# EAGLE design HID-Bridge-FTDI_proto (EAGLE 6.5.0)
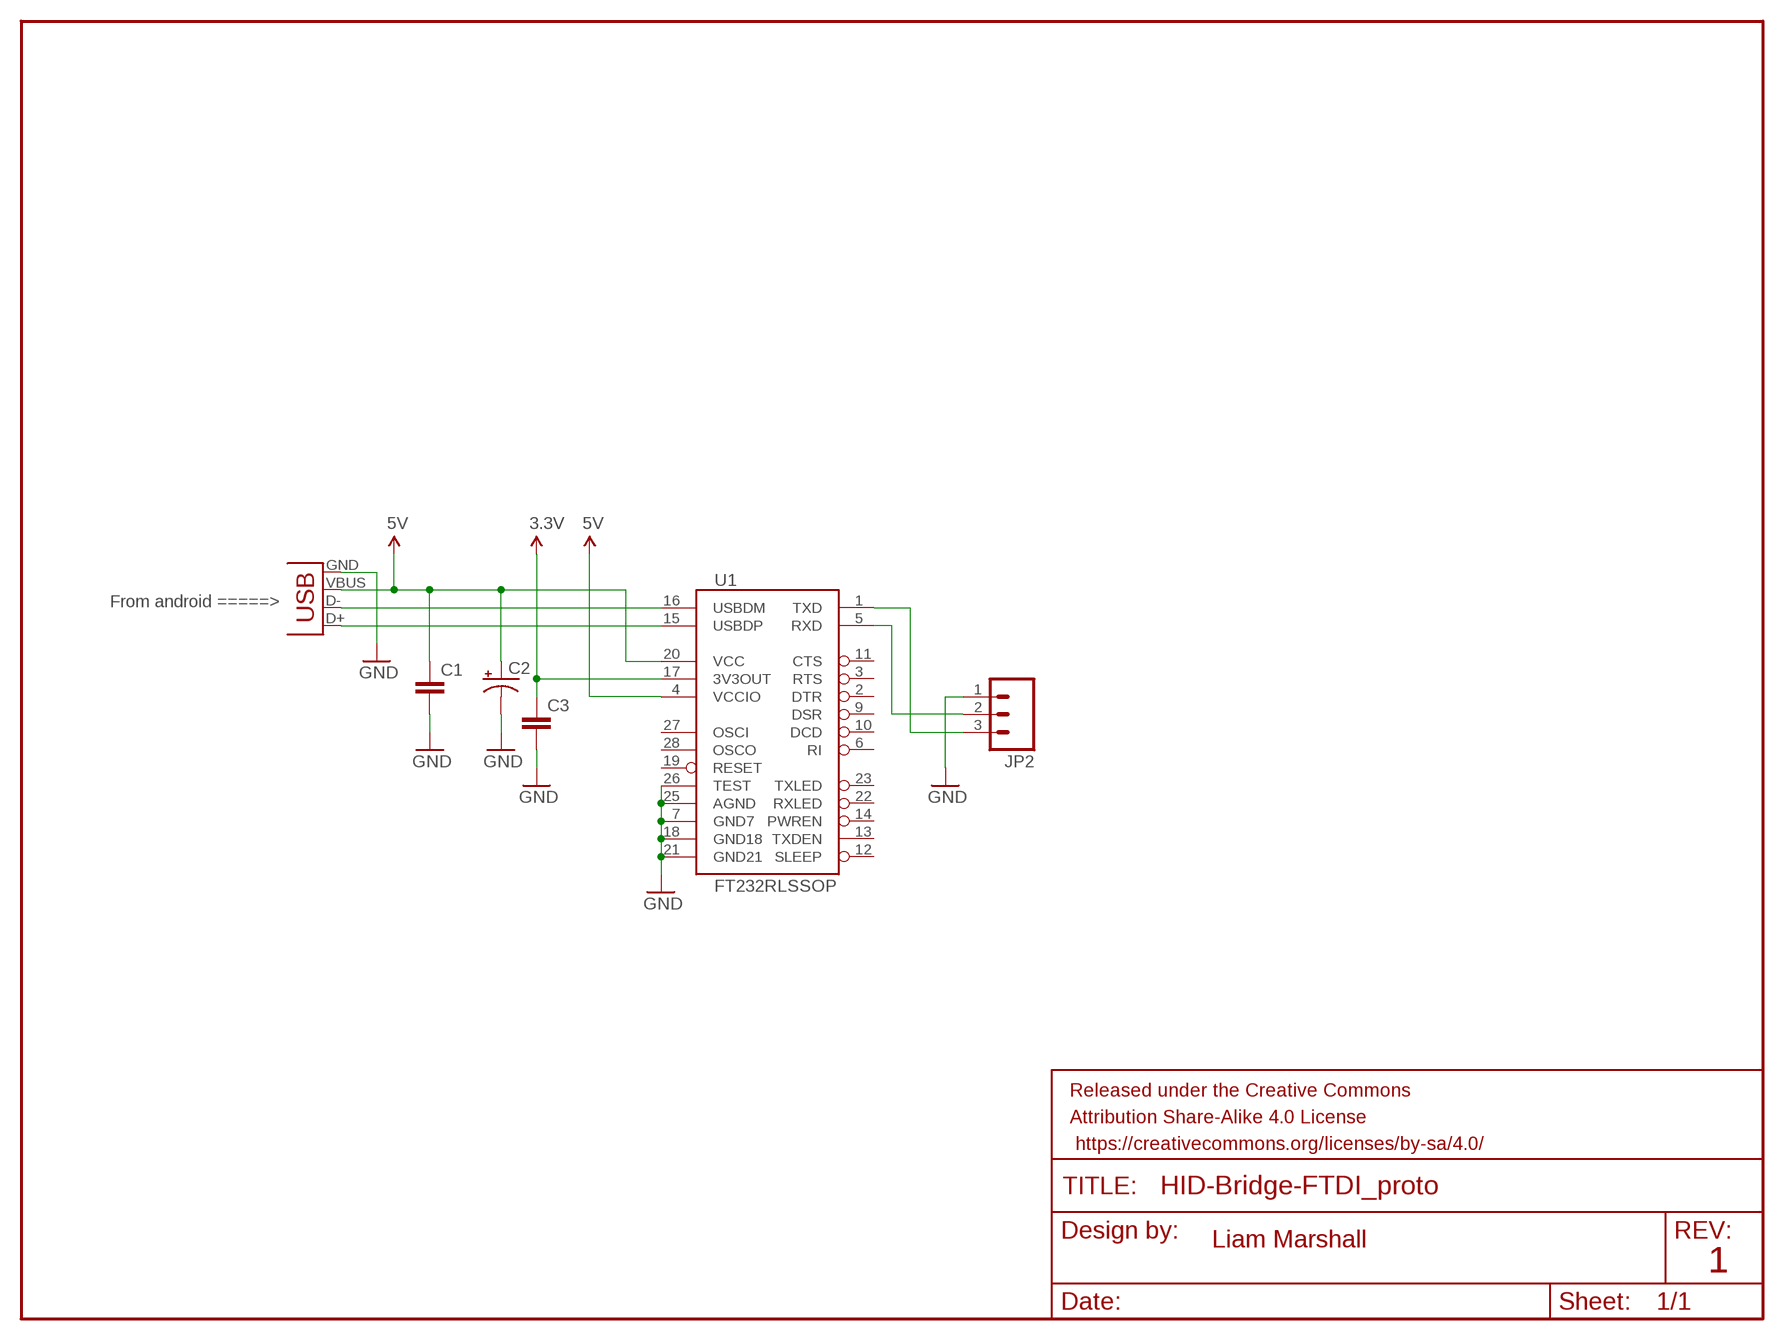
[diagram p0: schematic, sheet 1]

## Parts
C1  0.1UF-50V-20%(PTH)KIT-EZ  [CAP-PTH-SMALL-KIT]
C2  10UF-25V-20%(PTH)  [CPOL-RADIAL-10UF-25V]
C3  0.1UF-50V-20%(PTH)KIT-EZ  [CAP-PTH-SMALL-KIT]
FRAME1  FRAME-LETTER  [CREATIVE_COMMONS]
JP1  USB-B  USBPTH  [USB-B-PTH]
JP2  M03PTH  [1X03]
U1  FT232RLSSOP  [SSOP28DB]

## Nets
3.3V: C3.1 U1.17(3V3OUT)
5V: C1.1 C2.1(+) JP1.VBUS U1.4(VCCIO) U1.20(VCC)
GND: C1.2 C2.2(-) C3.2 JP1.GND JP2.1 U1.7(GND7) U1.18(GND18) U1.21(GND21) U1.25(AGND) U1.26(TEST)
N$1: JP2.2 U1.5(RXD)
N$2: JP1.D+ U1.15(USBDP)
N$3: JP1.D- U1.16(USBDM)
N$4: JP2.3 U1.1(TXD)
Unconnected: U1.2(DTR) U1.3(RTS) U1.6(RI) U1.9(DSR) U1.10(DCD) U1.11(CTS) U1.12(SLEEP) U1.13(TXDEN) U1.14(PWREN) U1.19(RESET) U1.22(RXLED) U1.23(TXLED) U1.27(OSCI) U1.28(OSCO)

## Notes on the sheet
- From android =====>
- Liam Marshall
- 1

## Library data of the parts
C1 C3 = SparkFun-Capacitors:0.1UF-50V-20%(PTH): CAP-08370; PROD_ID: CAP-08370
C2 = SparkFun-Capacitors:10UF-25V-20%(PTH): CAP-08440; PROD_ID: CAP-08440
FRAME1 = SparkFun-Aesthetics:FRAME-LETTER: Schematic Frame Standard 8.5x11 US Letter frame
JP1 = SparkFun-Connectors:USB: USB Connectors USB-B-PTH is fully proven SKU : PRT-00139/CONN-08278 USB-miniB is fully proven SKU : PRT-00587 USB-A-PCB is untested. USB-A-H is throughly reviewed, but untested. Spark Fun Electronics SKU : PRT-00437 USB-B-SMT is throughly reviewed, but untested. Needs silkscreen touching up. USB-A-S has not been used/tested USB-MB-H has not been used/tested USB-MICROB has been used. CONN-09505; PROD_ID: CONN-08278
JP2 = SparkFun-Connectors:M03: Header 3 Standard 3-pin 0.1" header. Use with straight break away headers (SKU : PRT-00116), right angle break away headers (PRT-00553), swiss pins (PRT-00743), machine pins (PRT-00117), and female headers (PRT-00115). Molex polarized connector foot print use with SKU : PRT-08232 with associated crimp pins and housings.
U1 = SparkFun-DigitalIC:FT232RL: USB UART FT232RL 4th Generation USB UART (USB <-> Serial) Controller. Spark Fun Electronics SKU : COM-00650 Production SKU IC-00870; PROD_ID: IC-00870

## Board
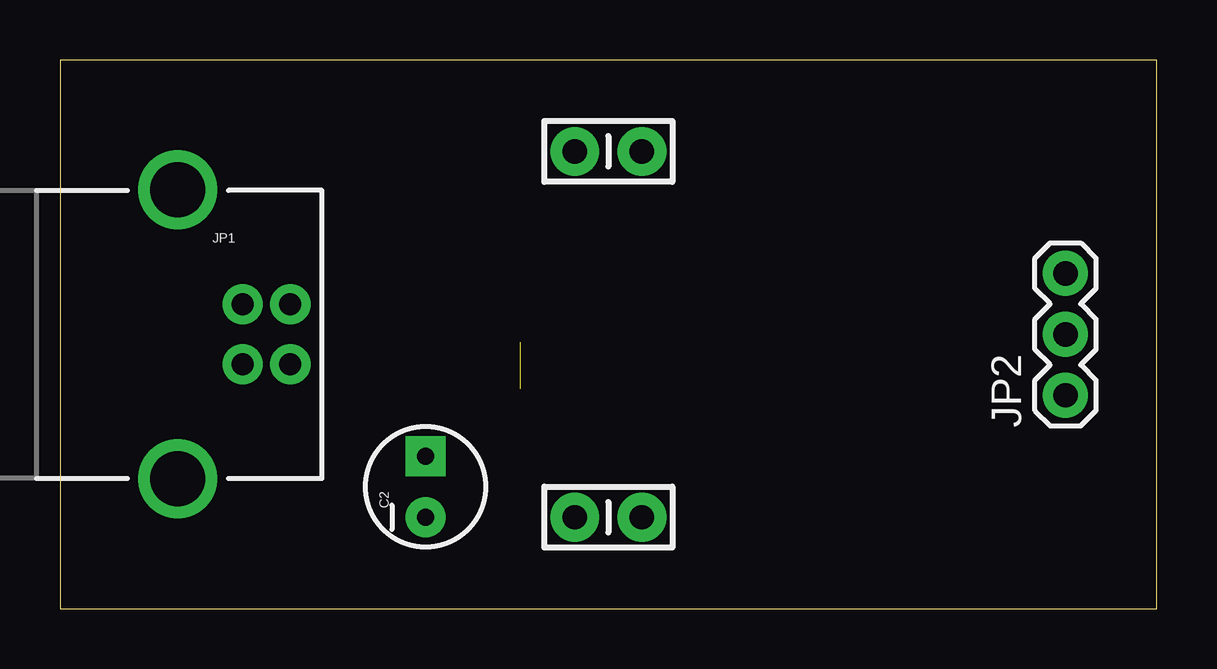
[diagram p1: board, top side]
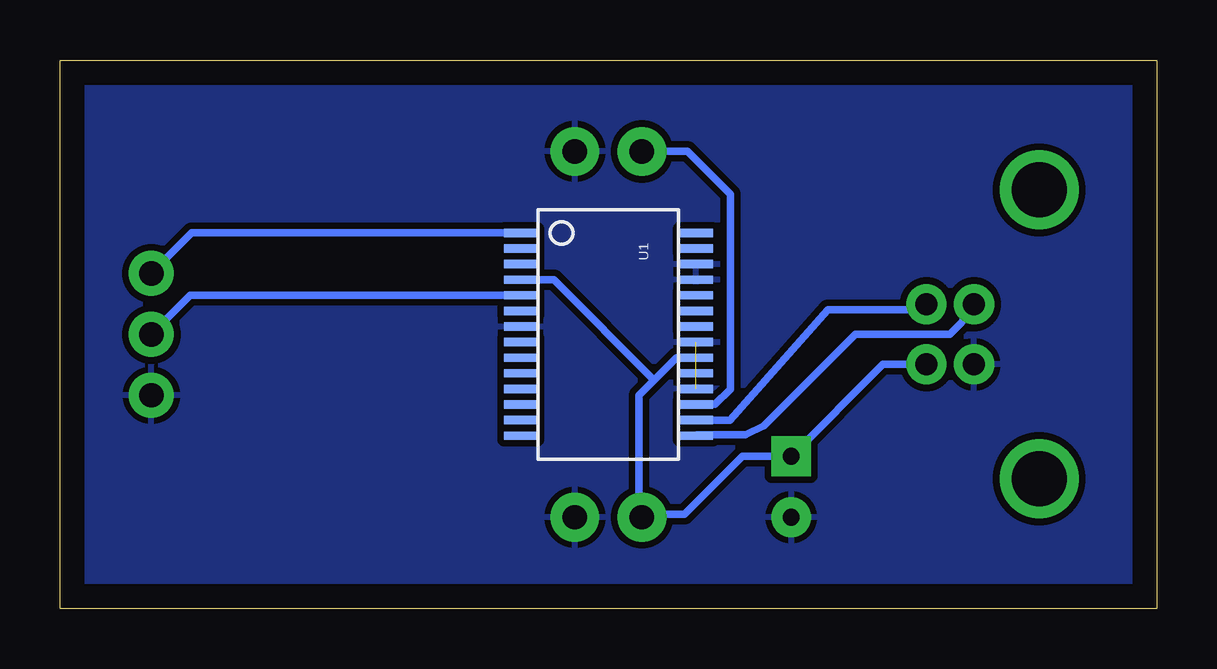
[diagram p2: board, bottom side, seen from below]

Size 45.72 x 22.86 mm. Coordinates in mm from the lower left corner, seen from the top.
Outline: 0,0 45.72,0 45.72,22.86 0,22.86 0,0
Copper layers (1*16): Top 0.035mm / dielectric 1.5mm / Bottom 0.035mm
Design rules "default": minimum track width 10mil, minimum drill 24mil, track to track 8mil, track to pad 8mil, pad to pad 8mil, via to via 8mil, smd to smd 8mil, copper to edge 40mil, drill to drill 8mil, minimum pad ring 10mil, minimum via ring 8mil, stop-mask expansion 4mil, vias tented up to drill 0mil, thermal gap 10mil

### Footprints (pad centres in the part's own frame; a part is rotated, then mirrored left to right if it is on the bottom)
CAP-PTH-SMALL-KIT = drill 1.016 pad 2.032: 1 -1.397,0; 2 1.397,0
CPOL-RADIAL-10UF-25V = drill 0.7 pad 1.651 square: 1 1.27,0 | drill 0.7 pad 1.651: 2 -1.27,0
USB-B-PTH = drill 0.914 pad 1.676: D+ 0,1.25; D- 1.981,1.25; GND 0,-1.25; VBUS 1.981,-1.25 | drill 2.286: S1 -2.718,-6.02; S2 -2.718,6.02
1X03 = drill 1.016 pad 1.88: 1 0,0; 2 2.54,0; 3 5.08,0
SSOP28DB = smd 0.348 x 1.397: 1 -4.225,-3.656; 2 -3.575,-3.656; 3 -2.925,-3.656; 4 -2.275,-3.656; 5 -1.625,-3.656; 6 -0.975,-3.656; 7 -0.325,-3.656; 8 0.325,-3.656; 9 0.975,-3.656; 10 1.625,-3.656; 11 2.275,-3.656; 12 2.925,-3.656; 13 3.575,-3.656; 14 4.225,-3.656; 15 4.225,3.656; 16 3.575,3.656; 17 2.925,3.656; 18 2.275,3.656; 19 1.625,3.656; 20 0.975,3.656; 21 0.325,3.656; 22 -0.325,3.656; 23 -0.975,3.656; 24 -1.625,3.656; 25 -2.275,3.656; 26 -2.925,3.656; 27 -3.575,3.656; 28 -4.225,3.656

### Placement (x,y rotation side)
C1  22.86,3.81 0 top
C2  15.24,5.08 90 top
C3  22.86,19.05 0 top
FRAME1  -1.27,26.67 0 top  (outside the outline)
JP1  7.62,11.43 0 top
JP2  41.91,8.89 90 top
U1  22.86,11.43 270 bottom

### Tracks (layer width: path | path; a pad name or v marks a point on that pad's centre or on a via)
3.3V
  Bottom 0.305: C3.1 19.56,19.05 17.78,17.27 17.78,9.14 18.41,8.51 U1.17
5V
  Bottom 0.305: JP1.VBUS 11.41,10.18 C2.1 17.27,6.35 19.68,3.94 21.34,3.94 C1.1 21.59,3.94 21.59,8.89 20.95,9.53 | U1.20 20.02,10.46 20.95,9.53 | U1.4 25.14,13.71 20.95,9.53
GND  (1 unrouted)
  pour Bottom (isolate 0.279): 0,22.86 0,0 45.72,0 45.72,22.86
N$1
  Bottom 0.305: U1.5 40.28,13.05 JP2.2
N$2
  Bottom 0.305: JP1.D+ 7.62,12.45 8.64,11.43 12.57,11.43 16.38,7.62 17.14,7.24 19.17,7.24 U1.15
N$3
  Bottom 0.305: U1.16 17.8,7.86 13.72,12.45 9.84,12.45 JP1.D-
N$4
  Bottom 0.305: U1.1 40.23,15.65 JP2.3

### Text on the board
tDocu: Liam Marshall